# Altium schematic sheet MCU.SchDoc
size A4
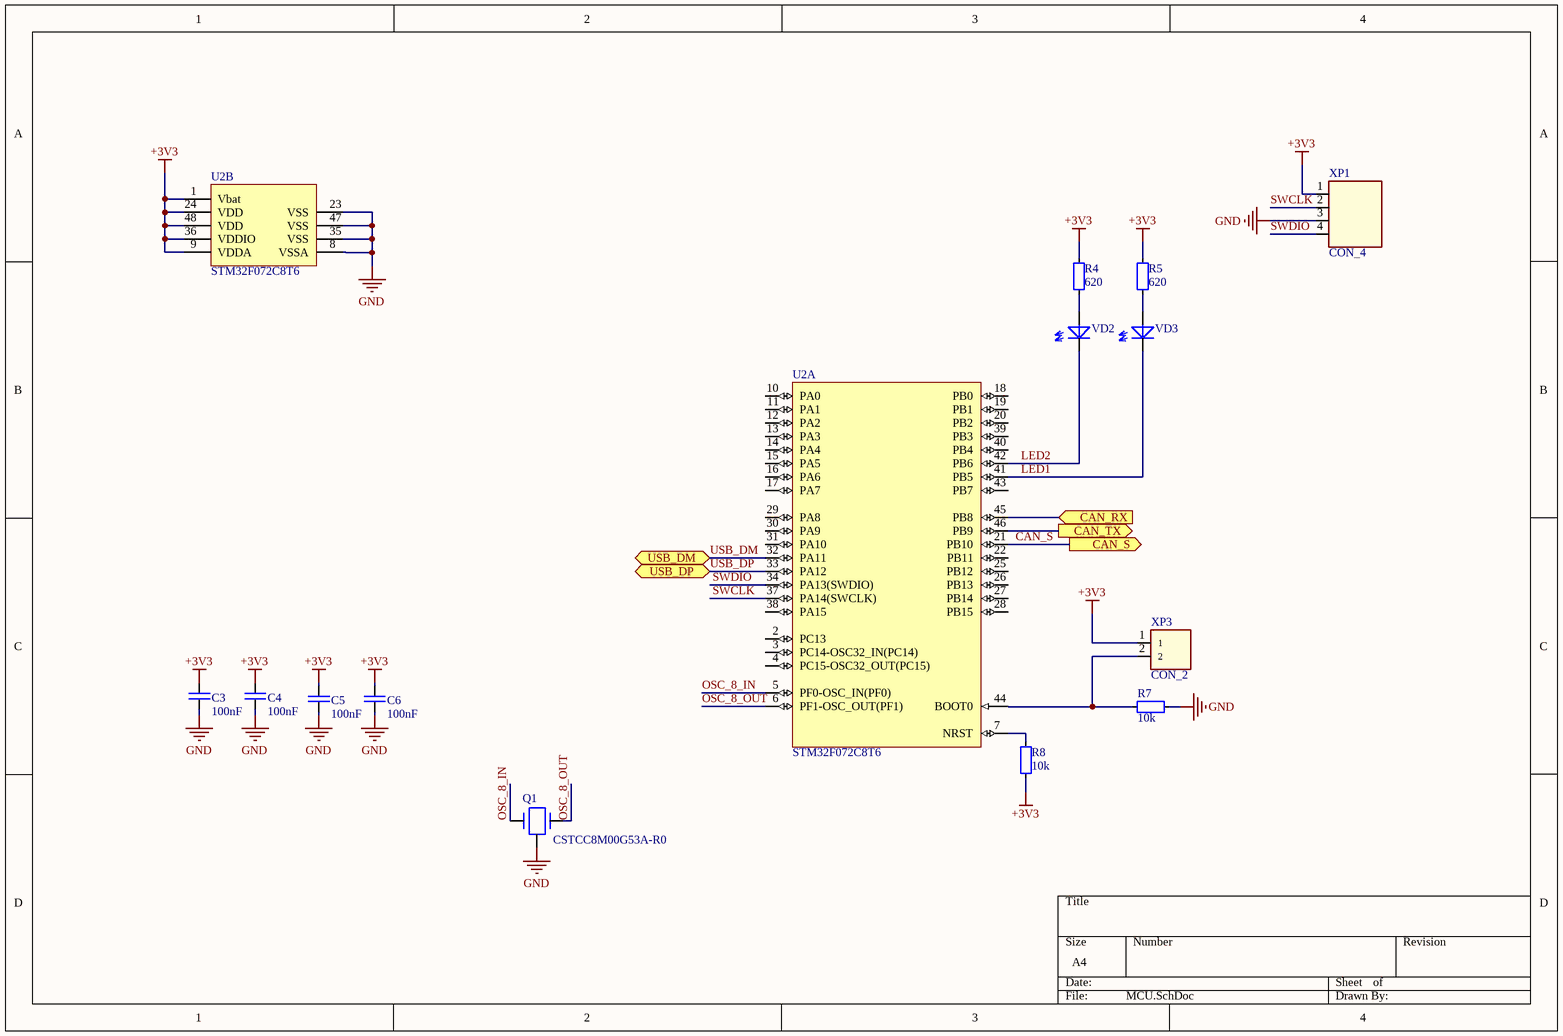
[diagram p0: MCU.SchDoc]

## Parts
C3  100nF  [CAP_0603]
C4  100nF  [CAP_0603]
C5  100nF  [CAP_0603]
C6  100nF  [CAP_0603]
Q1  CSTCC8M00G53A-R0  [CSTCC-CRYSTAL]
R4  620  [SMD_0603]
R5  620  [SMD_0603]
R7  10k  [SMD_0603]
R8  10k  [SMD_0603]
U2  STM32F072C8T6  [QFN48-7x7-0.5]  (parts A,B of 2)
VD2  (no value)  [LED_0603]
VD3  (no value)  [LED_0603]
XP1  CON_4  [HEAD_MICRO_SF_1.27-4]
XP3  CON_2  [HEAD_MICRO_SF_1.27-2]

## Ports
CAN_RX (in), CAN_S (out), CAN_TX (out), USB_DM (bidir), USB_DP (bidir)

## Nets
+3V3: C3.1 C4.1 C5.1 C6.1 R4.1 R5.1 R8.2 U2.1(Vbat) U2.9(VDDA) U2.24(VDD) U2.36(VDDIO) U2.48(VDD) XP1.1 XP3.1
GND: C3.2 C4.2 C5.2 C6.2 Q1.2 R7.1 U2.8(VSSA) U2.23(VSS) U2.35(VSS) U2.47(VSS) XP1.3
CAN_RX: U2.45(PB8) ; port CAN_RX
CAN_S: U2.21(PB10) ; port CAN_S
CAN_TX: U2.46(PB9) ; port CAN_TX
LED1: U2.41(PB5) VD3.1(C)
LED2: U2.42(PB6) VD2.1(C)
OSC_8_IN: Q1.1 U2.5(PF0-OSC_IN(PF0))
OSC_8_OUT: Q1.3 U2.6(PF1-OSC_OUT(PF1))
SWCLK: U2.37(PA14(SWCLK)) XP1.2
SWDIO: U2.34(PA13(SWDIO)) XP1.4
USB_DM: U2.32(PA11) ; port USB_DM
USB_DP: U2.33(PA12) ; port USB_DP
NetR4_2: R4.2 VD2.2(A)
NetR5_2: R5.2 VD3.2(A)
NetR7_2: R7.2 U2.44(BOOT0) XP3.2
NetR8_1: R8.1 U2.7(NRST)

Not connected (* = marked no-connect by the designer): U2 2(PC13) 3(PC14-OSC32_IN(PC14)) 4(PC15-OSC32_OUT(PC15)) 10(PA0) 11(PA1) 12(PA2) 13(PA3) 14(PA4) 15(PA5) 16(PA6) 17(PA7) 18(PB0) 19(PB1) 20(PB2) 22(PB11) 25(PB12) 26(PB13) 27(PB14) 28(PB15) 29(PA8) 30(PA9) 31(PA10) 38(PA15) 39(PB3) 40(PB4) 43(PB7)

## Library data of the parts
C3-C6 = C_NONE_POLAR: None polar capacitor; Value: 100nF
Q1 = CRYSTAL_CAP: Crystal oscillator; Value: CSTCC8M00G53A-R0; Model: CSTCC8M00G53A-R0
R4 R5 R7 R8 = RES: Resistor
  R4 R5: Value: 620
  R7 R8: Value: 10k
U2 = STM32F072C8T6: ARM Cortex-M0 32-bit MCU, 64 KB Flash, 8 KB Internal RAM, 39 I/Os, 48-pin LQFP, -40 to 85 degC, Tray; PartNumber: STM32F030C8T6; FLASH Size (Prog) (kB): 64; I/Os (High Current): 39; Internal RAM Size (kB): 8; Operating Frequency(F) (Processor speed) (MHz): 48; Supply Voltage(Vcc) min (V): 2.4; DatasheetVersion: Rev. 1; PackageVersion: Rev. 6, 06/2013; PackageReference: LQFP48; PackageDescription: 48-Pin Low Profile Quad Flat Package, 7 x 7 mm Body, 0.5 mm Pitch; Supplier 1: Digi-Key; Supplier Part Number 1: 497-14043-ND; Supplier 2: Newark; Supplier Part Number 2: 06X3647; Supplier 3: Mouser; Supplier Part Number 3: 511-STM32F030C8T6; Core: ARM Cortex-M0; Packing: Tray; Mounting Technology: Surface Mount; ComponentLink1Description: Manufacturer URL; ComponentLink1URL: http://www.st.com/web/en/home.html; ComponentLink2Description: Datasheet; ComponentLink2URL: http://www.st.com/st-web-ui/static/active/en/resource/technical/document/datasheet/DM00088500.pdf; ComponentLink3Description: Package Specification; ComponentLink3URL: http://www.st.com/st-web-ui/static/active/en/resource/technical/document/datasheet/DM00058181.pdf
VD2 VD3 = LED